# EAGLE design icetube (EAGLE 6.5.0)
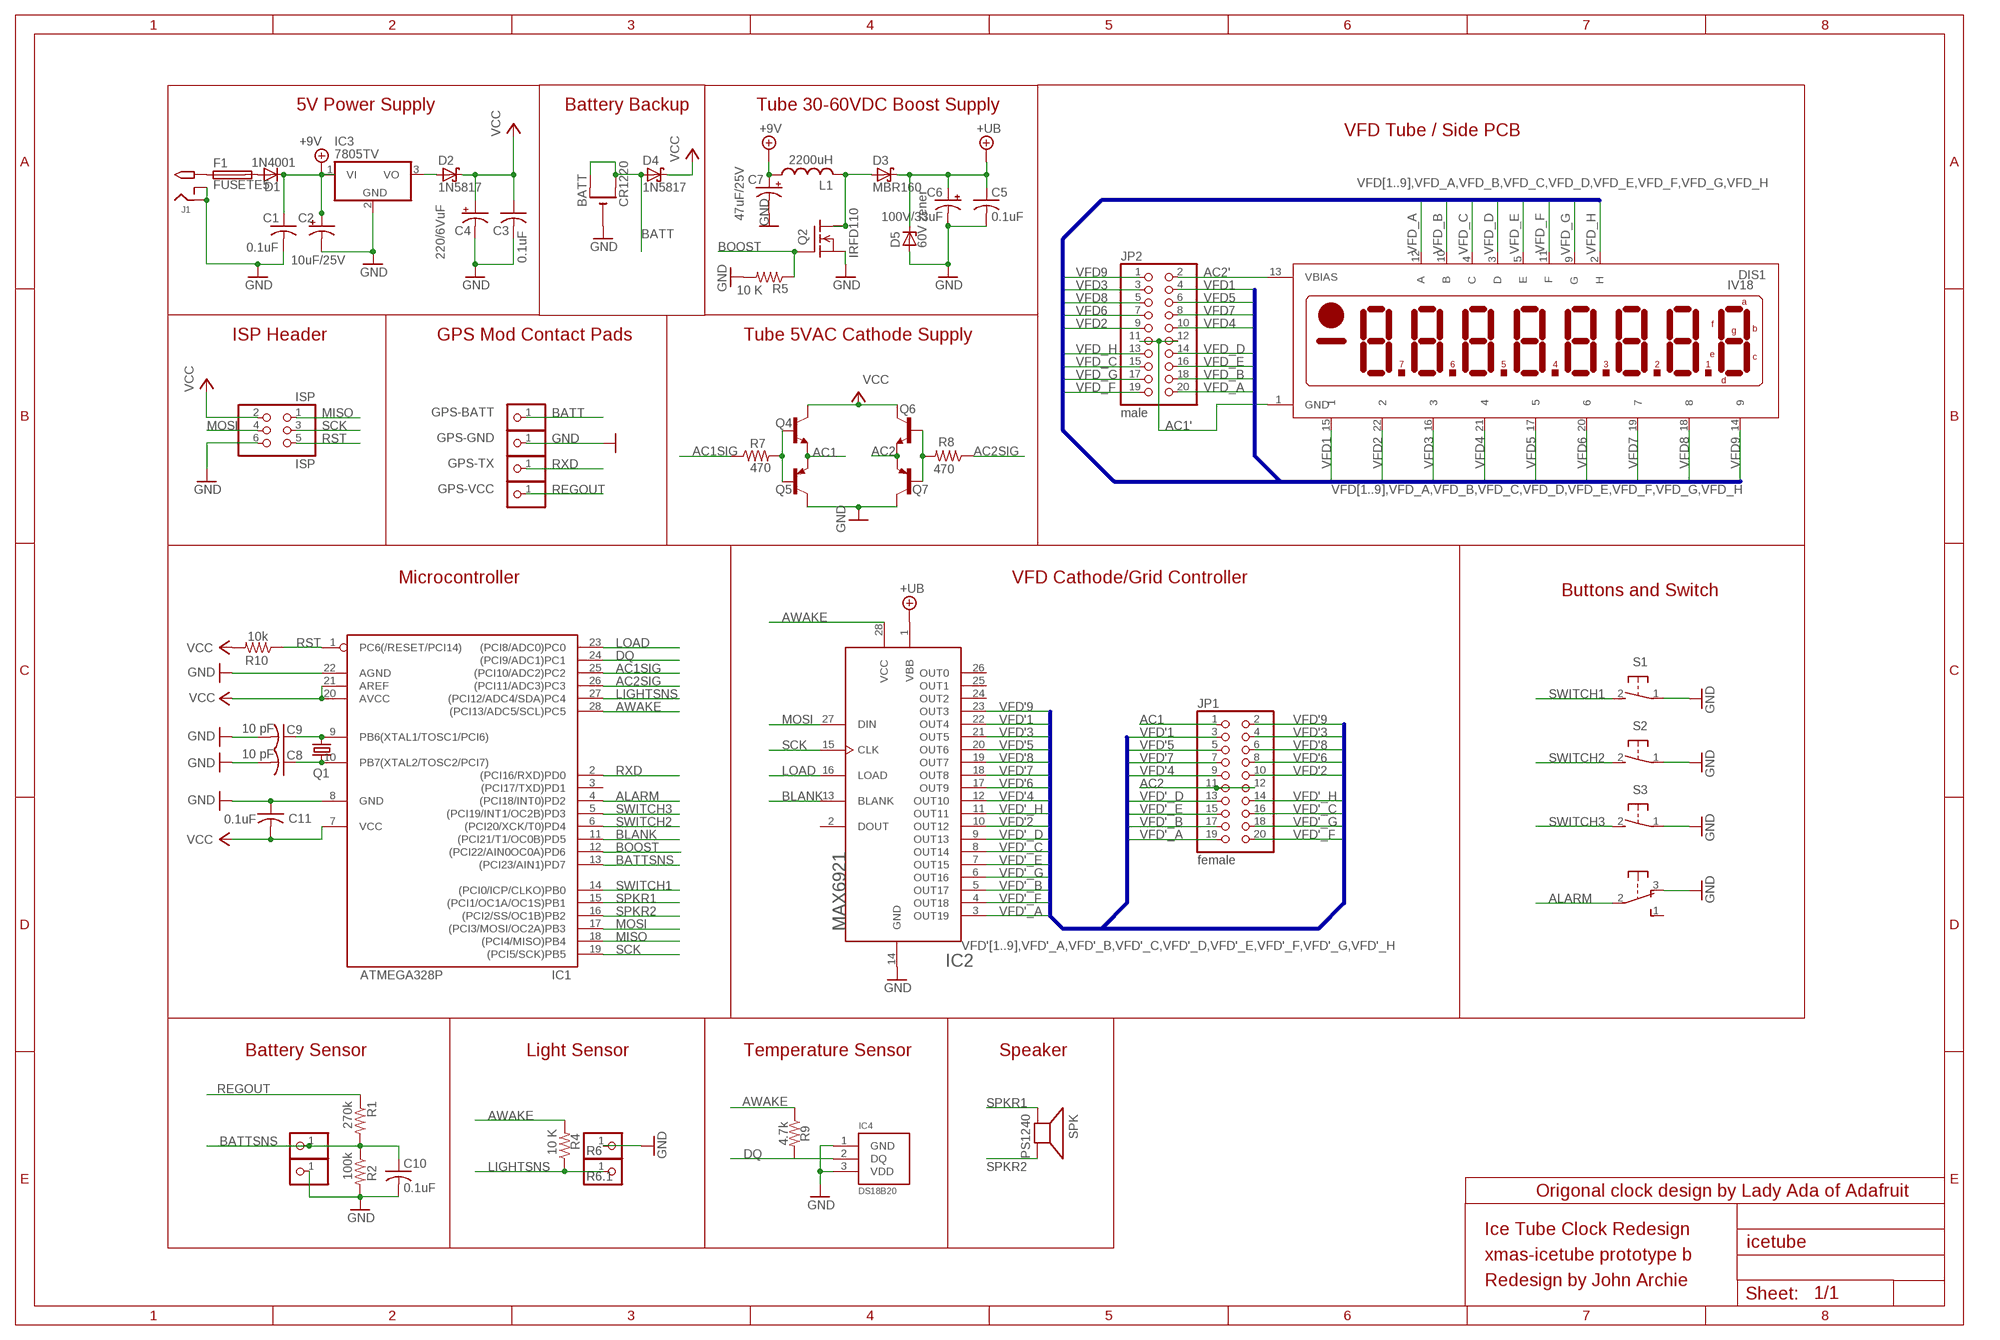
[diagram p0: schematic, sheet 1]

## Parts
BATT  CR1220  CR1220THM  [CR1220-THM]
C1  0.1uF  C-US025-025X050  [C025-025X050]
C2  10uF/25V  CPOL-USE2.5-6  [E2,5-6]
C3  0.1uF  C-US025-025X050  [C025-025X050]
C4  220/6VuF  CPOL-USE2.5-6  [E2,5-6]
C5  0.1uF  C-US025-024X044  [C025-024X044]
C6  100V/33uF  CPOL-USE3.5-8  [E3,5-8]
C7  47uF/25V  CPOL-USE2.5-6  [E2,5-6]
C8  10 pF  C-US025-024X044  [C025-024X044]
C9  10 pF  C-US025-024X044  [C025-024X044]
C10  0.1uF  C-US025-024X044  [C025-024X044]
C11  0.1uF  C-US025-025X050  [C025-025X050]
CT2  PINHD-1X1  [1X01]
CT3  PINHD-1X1  [1X01]
D1  1N4001  1N4004  [DO41-10]
D2  1N5817  SCHOTTKY-DIODEDO41  [DO41-10]
D3  MBR160  SCHOTTKY-DIODEDO41  [DO41-10]
D4  1N5817  SCHOTTKY-DIODEDO41  [DO41-10]
D5  60V zener  ZENER-DIODEDO41Z10  [DO41Z10]
DIS1  IV18  [IV18]
F1  FUSETE5  [TE5]
GPS-BATT  PINHD-1X1  [1X01]
GPS-GND  PINHD-1X1  [1X01]
GPS-TX  PINHD-1X1  [1X01]
GPS-VCC  PINHD-1X1  [1X01]
IC1  ATMEGA328P  ATMEGA168PROUND  [DIL28/3]
IC2  MAX6921  [PLCC-S28]
IC3  7805TV  [TO220V]
IC4  DS18B20  [TO92]
ISP  ISP  PINHD-2X3  [2X03]
J1  2.1MMJACK  [PJ-102A]
JP1  female  PINHD-2X10  [2X10]
JP2  male  PINHD-2X10  [2X10]
L1  2200uH  L  [6000]
Q1  32.768 khz  CRYTALTC26V  [TC26V]
Q2  IRFD110  [DIL04]
Q4  -NPN-TO92-EBC  [TO92-EBC]
Q5  -PNP-TO92-EBC  [TO92-EBC]
Q6  -NPN-TO92-EBC  [TO92-EBC]
Q7  -PNP-TO92-EBC  [TO92-EBC]
R1  270k  R-US_0207/10  [0207/10]
R2  100k  R-US_0207/10  [0207/10]
R4  10 K  R-US_0207/5V  [0207/5V]
R5  10 K  R-US_0207/5V  [0207/5V]
R6  PINHD-1X1  [1X01]
R6.1  PINHD-1X1  [1X01]
R7  470  R-US_0207/5V  [0207/5V]
R8  470  R-US_0207/5V  [0207/5V]
R9  4.7k  R-US_0207/10  [0207/10]
R10  10k  R-US_0207/5V  [0207/5V]
S1  31-XX  [B3F-31XX]
S2  31-XX  [B3F-31XX]
S3  31-XX  [B3F-31XX]
SPK  PS1240  SPEAKER/PS12  [PS12]
SW1  OS102011MA1Q  [OS102011MA1Q]

## Nets
+9V: C1.1 C2.+ C7.+ D1.C IC3.1(VI) L1.1
+UB: C5.1 C6.+ D3.C D5.C IC2.1(VBB)
AC1: JP1.1 Q4.E Q5.E
AC1': DIS1.1(GND) JP2.11 JP2.12
AC1SIG: IC1.25((PCI10/ADC2)PC2) R7.1
AC2: JP1.11 JP1.12 Q6.E Q7.E
AC2': DIS1.13(VBIAS) JP2.2
AC2SIG: IC1.26((PCI11/ADC3)PC3) R8.1
ALARM: IC1.4((PCI18/INT0)PD2) SW1.2(P)
AWAKE: IC1.28((PCI13/ADC5/SCL)PC5) IC2.28(VCC) R4.2 R9.1
BATT: BATT.+1(+) BATT.+2(+1) D4.A GPS-BATT.1
BATTSNS: C10.1 CT2.1 IC1.13((PCI23/AIN1)PD7) R1.2 R2.1
BLANK: IC1.11((PCI21/T1/OC0B)PD5) IC2.13(BLANK)
BOOST: IC1.12((PCI22/AIN0OC0A)PD6) Q2.3(G) R5.1
DQ: IC1.24((PCI9/ADC1)PC1) IC4.2(DQ) R9.2
GND: BATT.- C1.2 C2.- C3.2 C4.- C5.2 C6.- C7.- C8.2 C9.2 C10.2 C11.1 CT3.1 D5.A GPS-GND.1 IC1.8(GND) IC1.22(AGND) IC2.14(GND) IC3.2(GND) IC4.1(GND) IC4.3(VDD) ISP.6 J1.RING J1.RING_SW Q2.4(S) Q5.C Q7.C R2.2 R5.2 R6.1 S1.1(P) S2.1(P) S3.1(P) SW1.3(O)
LIGHTSNS: IC1.27((PCI12/ADC4/SDA)PC4) R4.1 R6.1.1
LOAD: IC1.23((PCI8/ADC0)PC0) IC2.16(LOAD)
MISO: IC1.18((PCI4/MISO)PB4) ISP.1
MOSI: IC1.17((PCI3/MOSI/OC2A)PB3) IC2.27(DIN) ISP.4
N$1: C9.1 IC1.9(PB6(XTAL1/TOSC1/PCI6)) Q1.2
N$2: D3.A L1.2 Q2.1(D) Q2.2(D1)
N$3: C8.1 IC1.10(PB7(XTAL2/TOSC2/PCI7)) Q1.1
N$4: F1.1 J1.TIP
N$5: D1.A F1.2
N$10: Q6.B Q7.B R8.2
N$22: Q4.B Q5.B R7.2
REGOUT: D2.A GPS-VCC.1 IC3.3(VO) R1.1
RST: IC1.1(PC6(/RESET/PCI14)) ISP.5 R10.1
RXD: GPS-TX.1 IC1.2((PCI16/RXD)PD0)
SCK: IC1.19((PCI5/SCK)PB5) IC2.15(CLK) ISP.3
SPKR1: IC1.15((PCI1/OC1A/OC1S)PB1) SPK.P$1(+)
SPKR2: IC1.16((PCI2/SS/OC1B)PB2) SPK.P$2(-)
SWITCH1: IC1.14((PCI0/ICP/CLKO)PB0) S1.2(S)
SWITCH2: IC1.6((PCI20/XCK/T0)PD4) S2.2(S)
SWITCH3: IC1.5((PCI19/INT1/OC2B)PD3) S3.2(S)
VCC: C3.1 C4.+ C11.2 D2.C D4.C IC1.7(VCC) IC1.20(AVCC) IC1.21(AREF) ISP.2 Q4.C Q6.C R10.2
VFD1: DIS1.15 JP2.4
VFD2: DIS1.22 JP2.9
VFD3: DIS1.16 JP2.3
VFD4: DIS1.21 JP2.10
VFD5: DIS1.17 JP2.6
VFD6: DIS1.20 JP2.7
VFD7: DIS1.19 JP2.8
VFD8: DIS1.18 JP2.5
VFD9: DIS1.14 JP2.1
VFD'1: IC2.22(OUT4) JP1.3
VFD'2: IC2.10(OUT12) JP1.10
VFD'3: IC2.21(OUT5) JP1.4
VFD'4: IC2.12(OUT10) JP1.9
VFD'5: IC2.20(OUT6) JP1.5
VFD'6: IC2.17(OUT9) JP1.8
VFD'7: IC2.18(OUT8) JP1.7
VFD'8: IC2.19(OUT7) JP1.6
VFD'9: IC2.23(OUT3) JP1.2
VFD'_A: IC2.3(OUT19) JP1.19
VFD'_B: IC2.5(OUT17) JP1.17
VFD'_C: IC2.8(OUT14) JP1.16
VFD'_D: IC2.9(OUT13) JP1.13
VFD'_E: IC2.7(OUT15) JP1.15
VFD'_F: IC2.4(OUT18) JP1.20
VFD'_G: IC2.6(OUT16) JP1.18
VFD'_H: IC2.11(OUT11) JP1.14
VFD_A: DIS1.12(A) JP2.20
VFD_B: DIS1.10(B) JP2.18
VFD_C: DIS1.4(C) JP2.15
VFD_D: DIS1.3(D) JP2.14
VFD_E: DIS1.5(E) JP2.16
VFD_F: DIS1.11(F) JP2.19
VFD_G: DIS1.9(G) JP2.17
VFD_H: DIS1.2(H) JP2.13
Unconnected: IC1.3((PCI17/TXD)PD1) IC2.2(DOUT) IC2.24(OUT2) IC2.25(OUT1) IC2.26(OUT0) SW1.1(S) SW1.MT1(MT) SW1.MT2(MT)

## Buses
VFD[1..9],VFD_A,VFD_B,VFD_C,VFD_D,VFD_E,VFD_F,VFD_G,VFD_H
VFD'[1..9],VFD'_A,VFD'_B,VFD'_C,VFD'_D,VFD'_E,VFD'_F,VFD'_G,VFD'_H

## Notes on the sheet
- 5V Power Supply | Battery Backup | Tube 30-60VDC Boost Supply
- VFD Tube / Side PCB
- ISP Header | GPS Mod Contact Pads | Tube 5VAC Cathode Supply
- Microcontroller | VFD Cathode/Grid Controller
- Buttons and Switch
- Battery Sensor | Light Sensor | Temperature Sensor | Speaker
- Origonal clock design by Lady Ada of Adafruit
- Ice Tube Clock Redesign
- xmas-icetube prototype b
- Redesign by John Archie

## Library data of the parts
BATT = vfd:CR1220
C1 C3 C11 = minimidi:C-US: CAPACITOR, American symbol
C2 C4 C7 = minimidi:CPOL-US: POLARIZED CAPACITOR, American symbol
C5 C10 = rcl-ez:C-US: CAPACITOR, American symbol
C6 = rcl-ez:CPOL-US: POLARIZED CAPACITOR, American symbol
C8 C9 = resistor:C-US: CAPACITOR, American symbol
CT2 CT3 GPS-BATT GPS-GND GPS-TX GPS-VCC R6 R6.1 = ybox2:PINHD-1X1: PIN HEADER
D1 = minimidi:1N4004: DIODE general purpose rectifier, 1 A
D2-D4 = usbbuck:SCHOTTKY-DIODE: Schottky Diode
D5 = diode:ZENER-DIODE: Z-Diode
DIS1 = vfd:IV18: LCD DISPLAY 8-character 7 segment
F1 = fuse:FUSE: Fuse
IC1 = avr:ATMEGA168*P: MICROCONTROLLER 16 kBytes FLASH 1 kBytes SRAM 512 Bytes EEPROM USART 8-channel 10 bit ADC
IC2 = vfd:MAX6921
IC3 = linear:78*: Positive VOLTAGE REGULATOR Source: http://cache.national.com/ds/LM/LM78L05.pdf http://www.fairchildsemi.com/ds/LM/LM7805.pdf
IC4 = jarchie:DS18B20
ISP = pinhead-ez:PINHD-2X3: PIN HEADER
J1 = minimidi:2.1MMJACK
JP1 JP2 = pinhead:PINHD-2X10: PIN HEADER
L1 = usbbuck:L
Q1 = crystal:CRYTAL: CRYSTAL
Q2 = vfd:IRFD110
Q4 Q6 = transistor-neu-to92:*-NPN-: NPN Transistror
Q5 Q7 = transistor-neu-to92:*-PNP-: PNP Transistror
R1 R2 R4 R5 R7-R10 = minimidi:R-US_: RESISTOR, American symbol
S1-S3 = switch-omron:31-XX: OMRON SWITCH
SPK = ybox2:SPEAKER: SPEAKER Source: Buerklin
SW1 = adaprog:OS102011MA1Q

## Net classes
0 default: clearance 0.205 mm

## Board
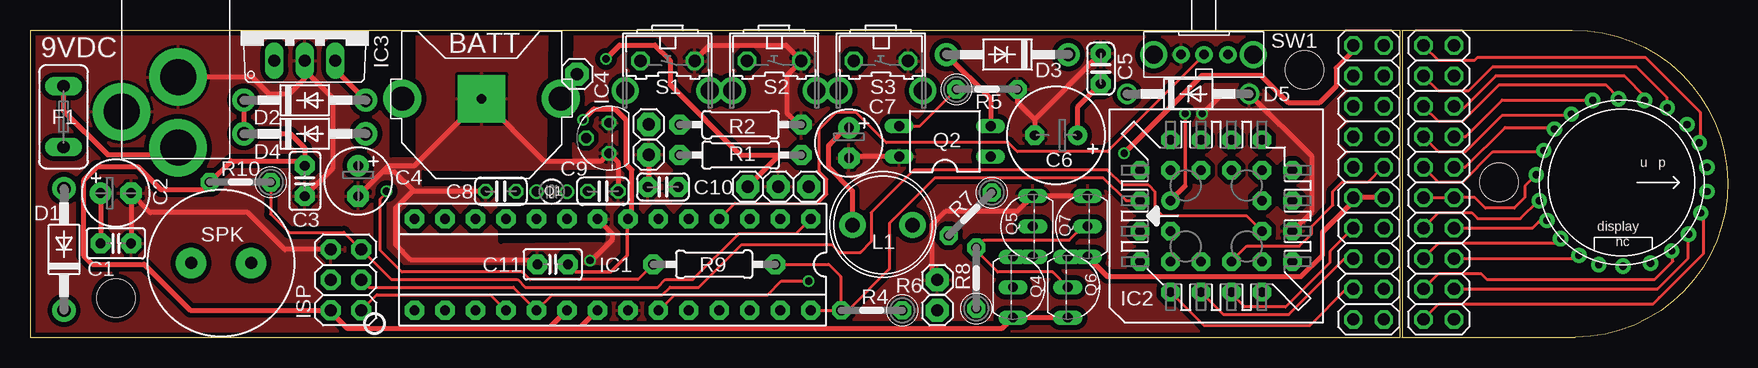
[diagram p1: board, top side]
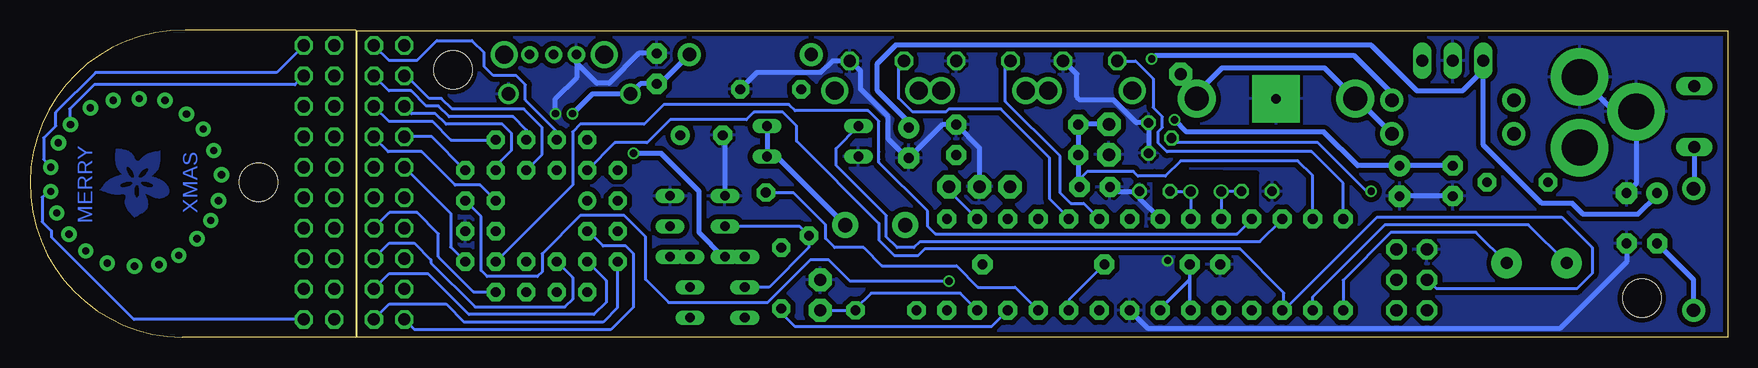
[diagram p2: board, bottom side, seen from below]

Size 141.47 x 25.68 mm. Coordinates in mm from the lower left corner, seen from the top.
Outline: 114.34,25.65 114.34,0
Outline: 114.3,0.03 128.77,0.03 arc180 128.52,25.68 114.3,25.68
Outline: 0,0.04 114.2,0.04 114.2,25.62 0,25.62 0,0.04
Copper layers (1*16): Top 0.0356mm / dielectric 1.5011mm / Bottom 0.0356mm
Design rules "LaenPCBOrder": minimum track width 6mil, minimum drill 13mil, track to track 6mil, track to pad 6mil, pad to pad 6mil, via to via 6mil, smd to smd 6mil, copper to edge 15mil, drill to drill 6mil, minimum pad ring 7mil, minimum via ring 7mil, stop-mask expansion 4mil, vias tented up to drill 0mil, thermal gap 10mil
Holes 3.2 mm at 106.21,22.35 122.42,12.98 7.15,3.3

### Footprints (pad centres in the part's own frame; a part is rotated, then mirrored left to right if it is on the bottom)
CR1220-THM = drill 2 pad 3.175: +1 -6.604,0; +2 6.604,0 | drill 0.8 pad 3.962 square: - 0,0
C025-025X050 = drill 0.813 pad 1.676 octagon: 1 -1.27,0; 2 1.27,0
E2,5-6 = drill 0.813 pad 1.778: + -1.27,0 | drill 0.813 pad 1.778 octagon: - 1.27,0
C025-024X044 = drill 0.813 pad 1.676 octagon: 1 -1.27,0; 2 1.27,0
E3,5-8 = drill 0.813 pad 1.6: + -1.778,0 | drill 0.813 pad 1.6 octagon: - 1.778,0
C025-024X044' = drill 0.813 octagon: 1 -1.27,0; 2 1.27,0
1X01 = drill 1.016 pad 1.93 octagon: 1 0,0
DO41-10 = drill 1.118 pad 1.93: A 5.08,0; C -5.08,0
DO41Z10 = drill 1.118: A 5.08,0; C -5.08,0
IV18 = drill 0.6 pad 1.27: 1 -0.635,-7.112; 2 1.524,-6.858; 3 3.175,-6.223; 4 4.699,-5.08; 5 6.096,-3.556; 6 6.858,-1.905; 7 6.985,0.127; 8 6.731,2.413; 9 5.715,4.191; 10 4.318,5.588; 11 2.54,6.604; 12 0.762,7.112; 13 -1.27,7.112; 14 -3.302,6.477; 15 -4.826,5.461; 16 -6.223,3.81; 17 -6.858,1.905; 18 -6.985,-0.254; 19 -6.858,-2.413; 20 -5.715,-4.191; 21 -4.445,-5.588; 22 -2.667,-6.477
TE5 = drill 1.016 long: 1 -2.54,0; 2 2.54,0
DIL28/3 = drill 0.813 pad 1.6 octagon: 1 -16.51,-3.81; 2 -13.97,-3.81; 3 -11.43,-3.81; 4 -8.89,-3.81; 5 -6.35,-3.81; 6 -3.81,-3.81; 7 -1.27,-3.81; 8 1.27,-3.81; 9 3.81,-3.81; 10 6.35,-3.81; 11 8.89,-3.81; 12 11.43,-3.81; 13 13.97,-3.81; 14 16.51,-3.81; 15 16.51,3.81; 16 13.97,3.81; 17 11.43,3.81; 18 8.89,3.81; 19 6.35,3.81; 20 3.81,3.81; 21 1.27,3.81; 22 -1.27,3.81; 23 -3.81,3.81; 24 -6.35,3.81; 25 -8.89,3.81; 26 -11.43,3.81; 27 -13.97,3.81; 28 -16.51,3.81
PLCC-S28 = drill 0.813 pad 1.524: 1 1.27,3.81 | drill 0.813 pad 1.524 octagon: 2 -1.27,6.35; 3 -1.27,3.81; 4 -3.81,6.35; 5 -6.35,3.81; 6 -3.81,3.81; 7 -6.35,1.27; 8 -3.81,1.27; 9 -6.35,-1.27; 10 -3.81,-1.27; 11 -6.35,-3.81; 12 -3.81,-6.35; 13 -3.81,-3.81; 14 -1.27,-6.35; 15 -1.27,-3.81; 16 1.27,-6.35; 17 1.27,-3.81; 18 3.81,-6.35; 19 6.35,-3.81; 20 3.81,-3.81; 21 6.35,-1.27; 22 3.81,-1.27; 23 6.35,1.27; 24 3.81,1.27; 25 6.35,3.81; 26 3.81,6.35; 27 3.81,3.81; 28 1.27,6.35
TO220V = drill 1.016 long: 1 -2.54,-2.54; 2 0,-2.54; 3 2.54,-2.54
TO92 = drill 0.813 octagon: 1 1.27,0; 2 0,1.905; 3 -1.27,0
2X03 = drill 1.016 pad 1.676 octagon: 1 -2.54,-1.27; 2 -2.54,1.27; 3 0,-1.27; 4 0,1.27; 5 2.54,-1.27; 6 2.54,1.27
PJ-102A = drill 3 pad 4.8: RING 0.1,-3.39; RING_SW -4.6,-6.29; TIP 0.1,-9.29
2X10 = drill 1.016 octagon: 1 -11.43,-1.27; 2 -11.43,1.27; 3 -8.89,-1.27; 4 -8.89,1.27; 5 -6.35,-1.27; 6 -6.35,1.27; 7 -3.81,-1.27; 8 -3.81,1.27; 9 -1.27,-1.27; 10 -1.27,1.27; 11 1.27,-1.27; 12 1.27,1.27; 13 3.81,-1.27; 14 3.81,1.27; 15 6.35,-1.27; 16 6.35,1.27; 17 8.89,-1.27; 18 8.89,1.27; 19 11.43,-1.27; 20 11.43,1.27
6000 = drill 1.2 pad 2.184: 1 -2.5,0; 2 2.5,0
TC26V = drill 0.813: 1 -1.27,0; 2 1.27,0
DIL04 = drill 0.813 long: 1 -1.27,-3.81; 2 1.27,-3.81; 3 1.27,3.81; 4 -1.27,3.81
TO92-EBC = drill 0.813 long: B 0,-1.27; C 2.54,-1.27; E -2.54,-1.27
0207/10 = drill 0.813 pad 1.676 octagon: 1 -5.08,0; 2 5.08,0
0207/5V = drill 0.813 pad 1.524 octagon: 1 -2.54,0; 2 2.54,0
B3F-31XX = drill 1.016 octagon: 1 -2.261,-1.245; 2 2.261,-1.245 | drill 1.499 pad 2.159: 3 -3.505,1.245; 4 3.505,1.245
PS12 = drill 1 pad 2.54: P$1 -2.5,0; P$2 2.5,0
OS102011MA1Q = drill 0.8 pad 1.422: 1 -2,0; 2 0,0; 3 1.9,0 | drill 1.5 pad 2.184: MT1 -4.1,0; MT2 4.2,0

### Placement (x,y rotation side)
BATT  37.63,19.94 0 top
C1  7.15,7.87 0 top
C2  7.15,12.06 0 top
C3  22.9,13.08 270 top
C4  27.35,13.08 270 top
C5  89.24,22.45 90 top
C6  85.51,16.89 180 top
C7  68.24,16.26 270 top
C8  10 pF  [C025-024X044']  39.24,12.22 180 top
C9  10 pF  [C025-024X044']  47.75,12.22 0 top
C10  52.75,12.57 180 top
C11  43.56,6.12 0 top
CT2  51.56,17.81 0 top
CT3  51.56,15.27 0 top
D1  2.84,7.37 90 top
D2  22.9,19.81 0 top
D3  81.45,23.62 180 top
D4  22.9,17.02 0 top
D5  96.52,20.35 0 top
DIS1  132.63,12.95 270 top
F1  2.79,18.44 270 top
GPS-BATT  45.59,22 0 top
GPS-GND  62.35,12.6 0 top
GPS-TX  64.89,12.6 0 top
GPS-VCC  59.81,12.6 0 top
IC1  48.56,6.1 180 top
IC2  98.85,10.16 90 top
IC3  22.9,25.65 0 top
IC4  48.25,16.66 90 top
ISP  26.33,4.83 90 top
J1  12.23,25.15 0 top
JP1  111.55,12.95 270 top
JP2  117.39,12.95 270 top
L1  71.04,9.4 0 top
Q1  43.48,12.19 0 top
Q2  76.24,16.38 90 top
Q4  83.18,4.22 270 top
Q5  82.29,9.3 90 top
Q6  87.75,4.22 270 top
Q7  86.86,9.3 90 top
R1  59.21,15.24 180 top
R2  59.21,17.78 0 top
R4  70.15,2.29 180 top
R5  79.75,20.73 0 top
R6  75.61,4.83 0 top
R6.1  75.61,2.29 0 top
R7  78.35,10.31 225 top
R8  78.86,4.98 90 top
R9  57.02,6.12 180 top
R10  17.52,12.98 180 top
S1  53.13,21.84 180 top
S2  62.02,21.84 180 top
S3  70.91,21.84 180 top
SPK  15.92,6.22 180 top
SW1  97.83,23.62 180 top

### Tracks (layer width: path | path; a pad name or v marks a point on that pad's centre or on a via)
+9V
  Top 0.406: C2.+ C1.1 | L1.1 68.54,12.26 66.54,14.25 66.54,16.03 66.73,16.22 68.04,17.53 C7.+
  Bottom 0.406: D1.C 2.84,4.83 C1.1 | C2.+ 5.88,11.92 7.49,10.31 12.06,10.31 12.95,11.2 15.49,11.2 20.36,16.07 IC3.1 20.36,22.33 22.09,20.6 25.9,20.6 29.71,24.41 69.34,24.41 70.86,22.89 70.86,20.6 68.24,17.98 C7.+
+UB  (via drill 0.6)
  Top 0.305: v96.26,18.69 96.26,12.65
  Top 0.406: 96.26,12.65 IC2.1 | C5.1 87.29,19.24 C6.+
  Bottom 0.406: v96.26,18.69 94.61,20.35 D5.C 90.6,21.18 C5.1 88.97,21.18 D3.C
AC1  (via drill 0.6)
  Top 0.406: v91.18,15.39 97.66,21.87 102.61,21.87 104.9,19.58 107.44,19.58 108.83,20.98 108.83,22.5 110.28,23.95 JP1.1
  Bottom 0.406: v91.18,15.39 88.9,15.39 85.72,12.22 85.72,8.79 83.69,6.76 Q5.E Q4.E
AC1'
  Top 0.254: DIS1.1 124.58,12.65 124.58,11.71 123.69,10.82 121.28,10.82 120.39,11.71 118.69,11.71 JP2.12 JP2.11
AC1SIG
  Bottom 0.254: IC1.25 59.38,4.22 62.48,4.22 64.26,5.99 70.48,5.99 72,7.52 74.42,7.52 75.18,8.28 75.18,9.42 77.86,12.11 R7.1
AC2
  Top 0.406: JP1.12 JP1.11 110.28,11.38 107.69,8.79 107.69,6.88 105.91,5.11 89.78,5.11 Q7.E Q6.E
AC2'
  Bottom 0.254: JP2.2 120.92,22.12 136.01,22.12 139.31,18.82 139.31,17.68 140.33,16.66 140.33,14.88 139.74,14.3 DIS1.13 139.77,14.25
AC2SIG
  Bottom 0.254: IC1.26 61.36,0.91 77.72,0.91 78.86,2.06 R8.1
ALARM
  Top 0.254: IC1.4 58.74,11.2 65.65,11.2 66.42,11.96 66.42,13.23 65.78,13.87 65.78,14 65.78,14.5 65.78,17.42 67.18,18.82 68.83,18.82 71.37,16.28 81.53,16.28 82.29,15.52 89.78,15.52 97.83,23.57 SW1.2
AWAKE
  Top 0.254: IC2.28 91.33,11.43 89.4,13.36 75.43,13.36 71.62,9.55 71.62,5.74 68.26,2.37 67.6,2.37 67.56,2.33 | R9.1 66.54,6.12 67.56,5.11 67.56,2.33 | IC1.28 R4.2 67.56,2.33
BATT
  Bottom 0.406: D4.A 30.9,19.94 BATT.+1 33.59,22.5 42.16,22.5 44.24,20.43 | 44.24,20.43 BATT.+2 | GPS-BATT.1 44.24,20.65 44.24,20.43
BATTSNS
  Bottom 0.254: IC1.13 34.59,13.53 35.81,14.76 45.59,14.76 46.86,13.49 49.14,13.49 49.52,13.87 53.37,13.87 54.13,13.11 54.13,12.68
  Bottom 0.406: CT2.1 54.1,17.81 R2.1 R1.2 54.13,12.68 C10.1
BLANK
  Bottom 0.254: IC1.11 39.67,9.88 40.89,8.66 66.04,8.66 66.67,9.3 66.67,10.57 70.73,14.63 70.73,14.88 70.73,15.52 70.73,18.06 71.62,18.95 77.72,18.95 78.23,19.46 88.64,19.46 90.29,17.81 95.63,17.81 96.26,17.17 96.26,12.73 102.64,6.35 IC2.13
BOOST
  Top 0.254: Q2.3 74.14,17.65 R5.1
  Bottom 0.254: Q2.3 74.29,15.8 74.29,14.38 70.1,10.19 70.1,8.41 69.21,7.52 67.81,7.52 67.31,8.03 38.98,8.03 37.13,9.88 IC1.12
DQ  (via drill 0.6)
  Top 0.254: R9.2 50.67,4.85 41.65,4.85 41.02,5.49 30.98,5.49 29.21,7.26 29.21,11.58 29.71,12.09 v29.71,12.22
  Bottom 0.254: 46.1,16.41 IC4.2 45.97,16.28 34.16,16.28 30.09,12.22 v29.71,12.22 | R9.2 54.91,3.15 IC1.24
GND  (via drill 0.6)
  Top 0.406: IC2.14 106.8,10.49 106.8,15.14 D5.A 99.34,20.35 v97.69,18.69 | Q7.C Q5.C 82.29,10.57 76.32,10.57 75.18,9.42 75.18,5.25 R6.1 | C1.2 C2.- 10.03,10.46 10.03,10.44 18.16,10.44 21.23,7.37 ISP.6 | 37.53,19.84 BATT.- | BATT.- 42.82,14.76 47.62,14.76 IC4.3 49.02,14.63 C9.2 | J1.RING 12.35,21.74 18.54,21.74 19.93,20.35 21.59,20.35 22.9,21.66 IC3.2 22.9,22.33 25.27,19.96 25.27,14.18 C3.2 | BATT.- 32.05,14.35 29.89,14.35 29.37,13.83 | C8.2 31.97,12.22 31.92,12.27 | C5.2 83.73,18.22 | R5.2 82.29,19.66 83.73,18.22 | CT3.1 51.56,12.65 C10.2 | S1.1 55.39,23.16 56.64,24.41 62.99,24.41 64.28,23.12 S2.1 63.11,21.92 63.11,18.69 64,17.81 64.26,17.81 R2.2 | C4.- 29.37,13.83 | 31.92,12.27 30.36,13.83 29.37,13.83 | C11.1 41.9,6.5 31.75,6.5 30.48,7.77 30.48,10.82 31.92,12.27 | IC1.8 48.51,8.68 48.51,8.15 46.79,6.44 v46.67,6.44 | Q2.4 68.37,15.11 C7.- | 83.73,18.22 C6.-
  Bottom 0.406: IC4.3 IC4.1 49.27,17.93 51.18,19.84 53.97,19.84 54.22,20.09 54.22,22 55.32,23.09 S1.1 | C5.2 90.73,23.72 93.21,21.23 94.23,21.23 95.93,22.94 SW1.3 95.88,23.57 95.88,21.74 97.69,19.94 v97.69,18.69 | 73.15,23.07 S3.1 | S3.1 74.59,23.09 75.56,22.12 80.89,22.12 R5.2 | J1.RING 9.43,18.86 J1.RING_SW 7.63,12.86 C2.- | IC1.8 49.02,11.64 C9.2 51.25,12.22 C10.2 | GPS-GND.1 62.35,15.84 R2.2 65.45,17.78 C7.- 68.37,14.99 69.97,16.59 69.97,18.44 72.26,20.73 72.26,22.25 73.1,23.09 S3.1 | IC1.22 48.33,0.79 13.96,0.79 8.38,6.38 8.38,7.83 C1.2 | C3.2 C4.- | C6.- 83.56,16.72 Q5.C
  pour Bottom (isolate 0.406, rank 2): -0.01,25.55 -0.01,0.03 114.17,0.03 114.17,7.01 114.17,25.68 -0.01,25.68
  pour Top (isolate 0.406, rank 2): -0.01,25.55 -0.01,0.03 114.17,0.03 114.17,25.68 -0.01,25.68
LIGHTSNS
  Bottom 0.254: IC1.27 63.95,3.71 71.37,3.71 72.69,2.39 R4.1 R6.1.1
LOAD  (via drill 0.6)
  Top 0.254: IC1.23 52.42,2.29 53.72,3.58 61.46,3.58 62.61,4.72 v64.89,4.72
  Bottom 0.254: IC2.16 103.88,10.11 103.88,5.61 103.37,5.11 99.18,5.11 98.8,5.49 98.8,7.01 95.63,10.19 91.94,10.19 90.17,8.41 90.17,4.85 88.26,2.95 80.01,2.95 76.45,6.5 74.93,6.5 73.15,4.72 v64.89,4.72
MISO
  Top 0.254: IC1.18 39.64,2.29 38.35,3.58 28.9,3.58 ISP.1
MOSI
  Bottom 0.254: ISP.4 24.99,4.83 24.25,4.09 12.57,4.09 11.3,5.36 11.3,7.52 13.84,10.06 29.21,10.06 36.98,2.29 IC1.17 36.98,2.43 36.98,3.73 40.63,7.39 66.92,7.39 67.43,6.88 69.46,6.88 70.73,8.15 70.73,9.55 77.59,16.41 77.59,17.68 78.73,18.82 81.15,18.82 81.78,18.19 88.13,18.19 90.04,16.28 92.73,16.28 IC2.27
N$1
  Bottom 0.254: IC1.9 Q1.2 44.77,12.22 C9.1
N$2
  Top 0.406: D3.A 80.05,19.94 Q2.2
  Bottom 0.406: Q2.2 Q2.1 | 80.03,15.14 Q2.1 | L1.2 79.25,15.11 Q2.1
N$3
  Bottom 0.254: IC1.10 Q1.1 42.18,12.22 C8.1
N$4
  Top 0.406: F1.1 2.79,18.95 6.47,15.27 11.74,15.27 J1.TIP
N$5
  Bottom 0.406: F1.2 2.79,12.49 D1.A
N$6
  cutout Bottom: 131.67,14.11 131.65,14.08 131.64,14.04 131.64,13.99 131.67,13.9 131.73,13.81 131.84,13.67 131.92,13.59 132.01,13.5 132.13,13.43 132.21,13.39 132.29,13.36 132.34,13.37 132.37,13.39 132.39,13.41 132.4,13.45 132.4,13.49 132.38,13.54 132.35,13.61 132.29,13.71 132.2,13.83 132.13,13.9 132.02,13.99 131.95,14.04 131.86,14.09 131.79,14.12 131.74,14.12 131.7,14.12
N$7
  cutout Bottom: 132.84,13.4 132.83,13.42 132.82,13.48 132.83,13.55 132.86,13.66 132.91,13.79 132.96,13.89 133.04,14.01 133.1,14.09 133.17,14.16 133.23,14.2 133.28,14.23 133.33,14.24 133.37,14.23 133.4,14.21 133.42,14.17 133.42,14.13 133.42,14.09 133.42,14.05 133.41,14 133.37,13.89 133.34,13.82 133.28,13.71 133.23,13.62 133.19,13.56 133.1,13.46 133.05,13.42 132.98,13.37 132.94,13.36 132.9,13.35 132.88,13.36 132.85,13.38
N$8
  cutout Bottom: 132.96,12.9 132.97,12.92 132.97,12.94 133,12.97 133.05,12.99 133.11,13 133.17,13 133.21,13.01 133.28,13 133.36,12.99 133.44,12.98 133.54,12.95 133.64,12.92 133.72,12.89 133.79,12.85 133.86,12.81 133.9,12.77 133.93,12.72 133.94,12.68 133.93,12.64 133.9,12.61 133.84,12.58 133.79,12.57 133.75,12.57 133.63,12.57 133.52,12.58 133.44,12.6 133.37,12.62 133.3,12.64 133.22,12.67 133.13,12.72 133.08,12.75 133.05,12.78 133.01,12.81 132.99,12.83 132.97,12.86 132.97,12.88
N$9
  cutout Top: 30.09,25.68 32,25.68 32,15.14 30.09,15.14
N$10
  Top 0.254: Q7.B 87.75,9.3 86.61,8.15 79.5,8.15 R8.2 78.86,7.26 80.64,5.49 85.21,5.49 Q6.B
N$11
  cutout Bottom: 132.76,12.21 132.75,12.09 132.74,11.96 132.7,11.85 132.67,11.79 132.63,11.74 132.59,11.71 132.55,11.71 132.52,11.73 132.49,11.77 132.46,11.82 132.43,11.89 132.42,11.94 132.41,12 132.4,12.07 132.39,12.13 132.39,12.32 132.4,12.41 132.41,12.46 132.42,12.5 132.44,12.55 132.46,12.61 132.47,12.64 132.49,12.66 132.51,12.69 132.53,12.71 132.55,12.72 132.59,12.72 132.61,12.71 132.65,12.67 132.67,12.64 132.69,12.59 132.71,12.55 132.73,12.47 132.75,12.39
N$13
  cutout Bottom: 131.47,12.57 131.4,12.57 131.34,12.58 131.29,12.6 131.27,12.61 131.24,12.64 131.23,12.66 131.23,12.69 131.24,12.72 131.26,12.75 131.29,12.78 131.34,12.82 131.43,12.88 131.53,12.92 131.59,12.94 131.66,12.96 131.73,12.98 131.83,13 131.89,13.01 131.94,13.01 132,13.01 132.06,13 132.11,12.99 132.16,12.97 132.18,12.95 132.19,12.94 132.2,12.92 132.2,12.88 132.19,12.85 132.16,12.81 132.12,12.77 132.08,12.74 132.03,12.72 131.98,12.69 131.93,12.67 131.87,12.64 131.79,12.61 131.69,12.59 131.62,12.58 131.54,12.57
N$14
  pour Bottom: 131.38,13.47 131.38,13.47 131.37,13.48 131.27,13.54 131.22,13.58 131.16,13.64 131.05,13.76 130.95,13.88 130.87,13.97 130.8,14.09 130.75,14.19 130.71,14.3 130.69,14.4 130.66,14.5 130.64,14.6 130.63,14.71 130.61,14.92 130.61,15.53 130.61,15.6 130.61,15.6 130.66,15.6 130.74,15.58 130.92,15.54 131.06,15.52 131.23,15.49 131.37,15.46 131.53,15.42 131.66,15.36 131.74,15.32 131.87,15.24 131.98,15.16 132.04,15.1 132.13,15.02 132.18,14.95 132.23,14.89 132.27,14.85 132.31,14.81 132.36,14.78 132.42,14.75 132.46,14.74 132.51,14.74 132.55,14.75 132.58,14.77 132.62,14.8 132.65,14.83 132.7,14.89 132.74,14.97 132.78,15.05 132.82,15.15 132.85,15.21 132.88,15.26 132.93,15.33 133,15.4 133.08,15.46 133.15,15.51 133.26,15.57 133.37,15.62 133.45,15.64 133.57,15.68 133.7,15.71 133.81,15.73 133.93,15.74 134.11,15.76 134.22,15.76 134.32,15.76 134.32,15.7 134.33,15.6 134.34,15.5 134.35,15.38 134.36,15.17 134.37,15.04 134.36,14.9 134.36,14.79 134.34,14.61 134.32,14.5 134.27,14.31 134.21,14.18 134.15,14.07 134.08,13.94 134,13.84 133.92,13.74 133.87,13.69 133.82,13.64 133.79,13.62 133.77,13.61 133.83,13.6 133.9,13.58 133.99,13.56 134.08,13.54 134.23,13.49 134.35,13.45 134.47,13.41 134.63,13.34 134.75,13.27 134.87,13.2 134.97,13.13 135.08,13.04 135.15,12.97 135.21,12.9 135.27,12.82 135.32,12.76 135.36,12.71 135.43,12.62 135.47,12.55 135.51,12.51 135.58,12.43 135.63,12.36 135.66,12.34 135.62,12.32 135.55,12.29 135.45,12.25 135.36,12.21 135.27,12.18 135.09,12.12 135,12.09 134.89,12.05 134.81,12.03 134.69,12 134.56,11.97 134.47,11.96 134.39,11.95 134.33,11.94 134.19,11.94 134.05,11.94 133.96,11.95 133.9,11.97 133.84,11.98 133.76,11.98 133.68,11.98 133.63,11.97 133.6,11.95 133.57,11.93 133.54,11.9 133.51,11.86 133.5,11.81 133.5,11.74 133.5,11.67 133.52,11.58 133.54,11.49 133.56,11.43 133.57,11.38 133.57,11.29 133.56,11.18 133.55,11.11 133.51,10.99 133.46,10.87 133.4,10.76 133.35,10.69 133.31,10.63 133.21,10.5 133.09,10.35 133.01,10.27 132.89,10.14 132.79,10.05 132.75,10.02 132.69,10.06 132.59,10.12 132.51,10.18 132.4,10.24 132.29,10.31 132.2,10.36 132.09,10.43 131.97,10.51 131.9,10.56 131.86,10.59 131.81,10.65 131.76,10.71 131.71,10.8 131.68,10.89 131.66,10.95 131.64,11.04 131.64,11.14 131.64,11.25 131.65,11.34 131.68,11.46 131.7,11.56 131.74,11.67 131.78,11.76 131.8,11.81 131.83,11.87 131.85,11.93 131.88,11.99 131.9,12.03 131.92,12.06 131.92,12.06 131.87,12.03 131.79,11.99 131.69,11.94 131.6,11.9 131.42,11.82 131.33,11.77 131.18,11.71 131.05,11.67 130.93,11.64 130.8,11.63 130.72,11.62 130.63,11.63 130.52,11.64 130.45,11.66 130.36,11.68 130.28,11.71 130.24,11.73 130.16,11.78 130.11,11.81 130.07,11.84 130.01,11.89 129.98,11.93 129.95,11.96 129.92,12.01 129.9,12.06 129.88,12.12 129.87,12.18 129.87,12.24 129.88,12.31 129.9,12.41 129.92,12.47 129.94,12.53 129.97,12.61 130.03,12.71 130.11,12.82 130.19,12.9 130.26,12.96 130.33,13.03 130.43,13.1 130.55,13.16 130.66,13.22 130.83,13.3 130.96,13.35 131.17,13.42 131.3,13.45
N$18
  cutout Bottom: 39.24,8.03 39.24,13.74 47.75,13.87 47.75,8.15
N$19
  cutout Top: 39.24,13.74 47.75,13.87 47.75,8.15 39.24,8.03
N$21
  cutout Top: 32.76,13.87 42.29,13.74 42.29,12.73 32.76,12.73
N$22
  Bottom 0.254: Q4.B 79.88,4.22 76.56,7.54 R7.2 77.34,9.3 Q5.B
N$23
  cutout Top: 43.3,25.68 43.17,15.01 45.08,15.01 45.21,25.68
REGOUT  (via drill 0.6)
  Top 0.406: IC3.3 25.44,22.35 D2.A | v48,23.27 49.14,24.41 52.06,24.41 53.34,23.14 53.34,21.11 59.2,15.24 R1.1 62.45,15.24 GPS-VCC.1
  Bottom 0.406: D2.A 27.98,20.39 31.11,23.52 47.75,23.52 v48,23.27
RST
  Top 0.254: IC1.1 63.82,8.66 59.05,8.66 55.24,4.85 52.95,4.85 52.32,4.22 41.27,4.22 40.63,4.85 30.12,4.85 ISP.5 27.58,7.37 26.16,8.79 21.59,8.79 20.06,10.31 R10.1
RXD
  Bottom 0.254: IC1.2 64.89,12.27 GPS-TX.1
SCK
  Top 0.254: ISP.3 28.21,4.22 40.28,4.22 IC1.19 43.5,3.58 52.7,3.58 53.34,4.22 55.75,4.22 59.3,7.77 66.8,7.77 67.43,7.14 69.21,7.14 70.1,8.03 70.1,10.44 73.66,14 89.78,14 91.05,12.73 93.21,12.73 93.72,12.22 93.72,10.82 94.36,10.19 101.36,10.19 IC2.15
SPKR1
  Bottom 0.254: IC1.15 32.05,4.8 28.06,8.79 20.98,8.79 SPK.P$1
SPKR2
  Bottom 0.254: IC1.16 34.59,3.41 28.57,9.42 16.76,9.42 16.62,9.42 SPK.P$2
SWITCH1
  Bottom 0.254: S1.2 49.35,23.09 47.87,21.62 47.87,19.2 47.11,18.44 47.11,17.55 47.49,17.17 47.49,16.28 46.73,15.52 34.67,15.52 32.05,12.9 IC1.14
SWITCH2
  Bottom 0.254: IC1.6 53.66,11.2 54.73,11.2 55.62,12.09 55.62,15.14 60.19,19.71 60.19,22.65 S2.2
SWITCH3
  Bottom 0.254: IC1.5 54.91,9.98 56.51,11.58 56.51,15.01 60.57,19.08 64.89,19.08 65.14,18.83 67.93,18.83 69.08,19.98 69.08,22.65 S3.2
VCC  (via drill 0.6)
  Top 0.305: 49.78,9.93 49.78,6.88 48.38,5.49 45.46,5.49 C11.2
  Top 0.406: D2.C D4.C 21.71,17.02 22.92,15.81 C3.1 22.9,14.37 22.52,14.75 16.75,14.75 R10.2 14.35,12.34 10.92,12.34 9.01,14.25 5.58,14.25 4.44,13.11 4.44,6.88 5.2,6.12 9.52,6.12 13.35,2.29 ISP.2 25.06,2.16 26.43,0.79 43.25,0.79 | 43.25,0.79 45.79,0.79 | 45.79,0.79 81.02,0.79 Q4.C Q6.C | IC1.21 45.79,0.79 | IC1.20 43.25,0.79 | v46.1,18.19 46.98,19.08 48.76,19.08 49.65,18.19 49.65,14.5 50.16,14 50.16,10.24 IC1.7 49.8,9.91 49.78,9.93
  Bottom 0.305: 44.83,2.31 C11.2 44.83,4.85 47.37,2.31
  Bottom 0.406: v46.1,18.19 45.08,17.17 33.65,17.17 30.83,14.35 C4.+ C3.1
VFD1
  Bottom 0.254: JP2.4 119.4,21.11 136.14,21.11 138.17,19.08 138.17,17.86 DIS1.15
VFD2
  Top 0.254: JP2.9 117.37,12.98 119.38,12.98 121.92,15.52 126.23,15.52 126.23,15.54 DIS1.22
VFD3
  Top 0.254: JP2.3 117.37,20.6 119.88,20.6 121.92,22.63 133.85,22.63 136.39,20.09 136.39,19.33 136.44,19.28 DIS1.16
VFD4
  Top 0.254: JP2.10 119.6,14.22 122.93,17.55 127.19,17.55 | 127.19,17.55 127.25,17.55 | 127.19,17.55 DIS1.21
VFD5
  Top 0.254: DIS1.17 134.56,19.84 134.62,19.84 134.62,20.09 132.84,21.87 122.17,21.87 119.38,19.08 119.12,19.08 118.87,19.33 118.84,19.3 JP2.6
VFD6
  Top 0.254: JP2.7 117.37,15.52 119.63,15.52 122.68,18.57 128.52,18.57 128.52,18.59 DIS1.20
VFD7
  Top 0.254: DIS1.19 130.19,19.84 122.68,19.84 119.63,16.79 118.87,16.79 118.84,16.76 JP2.8
VFD8
  Top 0.254: JP2.5 117.37,18.06 119.38,18.06 122.42,21.11 131.31,21.11 132.33,20.09 132.33,19.89 | 132.33,19.89 132.33,19.84 | 132.33,19.89 DIS1.18
VFD9
  Top 0.254: JP2.1 117.37,23.14 120.39,23.14 120.65,23.39 134.62,23.39 139.19,18.82 139.19,16.28 139.13,16.28 DIS1.14
VFD'1
  Bottom 0.254: 110.21,21.84 JP1.3 110.08,21.84 108.2,19.96 107.18,19.96 106.29,19.08 100.33,19.08 98.8,17.55 98.8,15.29 IC2.22
VFD'2
  Top 0.254: IC2.10 101.41,7.65 105.79,7.65 106.8,8.66 106.8,9.3 108.58,11.07 108.58,12.22 109.34,12.98 111.5,12.98 112.75,14.22 JP1.10
VFD'3
  Bottom 0.254: IC2.21 100.12,17.34 101.21,18.44 106.55,18.44 107.44,19.33 108.45,19.33 109.72,20.6 111.57,20.6 JP1.4
VFD'4
  Bottom 0.254: JP1.9 106.42,10.37 106.42,7.57 IC2.12
VFD'5
  Bottom 0.254: IC2.20 102.66,14.33 101.34,15.65 101.34,17.04 102.1,17.81 106.8,17.81 107.69,18.69 109.67,18.69 JP1.5
VFD'6
  Bottom 0.254: IC2.17 103.95,12.73 106.04,12.73 108.83,15.52 111.63,15.52 112.82,16.71 JP1.8
VFD'7
  Bottom 0.254: IC2.18 107.99,16.76 JP1.7
VFD'8
  Bottom 0.254: JP1.6 111.57,18.06 107.95,18.06 106.4,16.51 IC2.19
VFD'9
  Bottom 0.254: JP1.2 111.57,23.14 109.22,23.14 107.56,24.79 104.64,24.79 103.63,23.77 103.63,22.63 102.87,21.87 100.96,21.87 100.2,21.11 100.2,19.84 97.53,17.17 97.53,16.56 IC2.23
VFD'_A
  Bottom 0.254: JP1.19 109.41,0.66 93.09,0.66 91.18,2.57 91.18,7.01 91.82,7.65 93.72,7.65 94.97,8.89 IC2.3
VFD'_B
  Top 0.254: IC2.5 97.81,1.04 106.68,1.04 109.7,4.06 JP1.17
VFD'_C
  Bottom 0.254: JP1.16 111.52,7.9 109.47,7.9 108.07,6.5 108.07,6.25 104.39,2.57 96.9,2.57 96.26,3.2 96.26,5.03 IC2.8
VFD'_D
  Top 0.254: JP1.13 108.33,7.19 108.33,6.25 104.64,2.57 101.21,2.57 100.12,3.66 IC2.9
VFD'_E
  Top 0.254: IC2.7 99.46,1.93 104.9,1.93 109.57,6.6 JP1.15
VFD'_F
  Bottom 0.254: JP1.20 111.52,2.82 106.8,2.82 105.28,1.3 93.72,1.3 92.5,2.52 IC2.4
VFD'_G
  Bottom 0.254: JP1.18 111.52,5.36 108.33,5.36 104.9,1.93 94.48,1.93 93.47,2.95 93.47,4.78 IC2.6
VFD'_H
  Bottom 0.254: JP1.14 111.52,10.44 109.22,10.44 107.44,8.66 107.44,6.76 104.52,3.84 102.68,3.84 IC2.11
VFD_A
  Bottom 0.254: JP2.20 132.81,1.52 139.69,8.41 139.69,8.92 140.46,9.68 140.46,11.71 139.95,12.22 139.92,12.19 DIS1.12
VFD_B
  Top 0.254: JP2.18 118.69,4.09 135.63,4.09 138.17,6.63 138.17,8.66 138.19,8.66 DIS1.10
VFD_C
  Top 0.254: JP2.15 117.42,7.9 127.76,7.9 127.76,8.05 DIS1.4
VFD_D
  Top 0.254: JP2.14 118.69,9.17 125.22,9.17 125.73,9.68 126.31,9.68 DIS1.3
VFD_E
  Top 0.254: DIS1.5 128.84,6.63 118.69,6.63 JP2.16
VFD_F
  Top 0.254: JP2.19 117.42,2.82 135.25,2.82 135.76,3.33 136.65,4.22 139.44,7.01 139.44,10.21 DIS1.11
VFD_G
  Top 0.254: JP2.17 117.42,5.36 120.9,5.36 121.41,4.85 135.38,4.85 136.9,6.38 136.9,7.16 DIS1.9
VFD_H
  Top 0.254: JP2.13 117.42,10.44 120.14,10.44 120.65,9.93 124.2,9.93 125.73,11.46 125.75,11.46 DIS1.2

### Text on the board
Bottom: MERRY | XMAS
tNames: 9VDC
bStop: REV B